# EAGLE schematic PROTO0001 (EAGLE 7.6.0)
ENGINEER: JTD; REV: A

## Sheet 1 of 4: Table of Contents
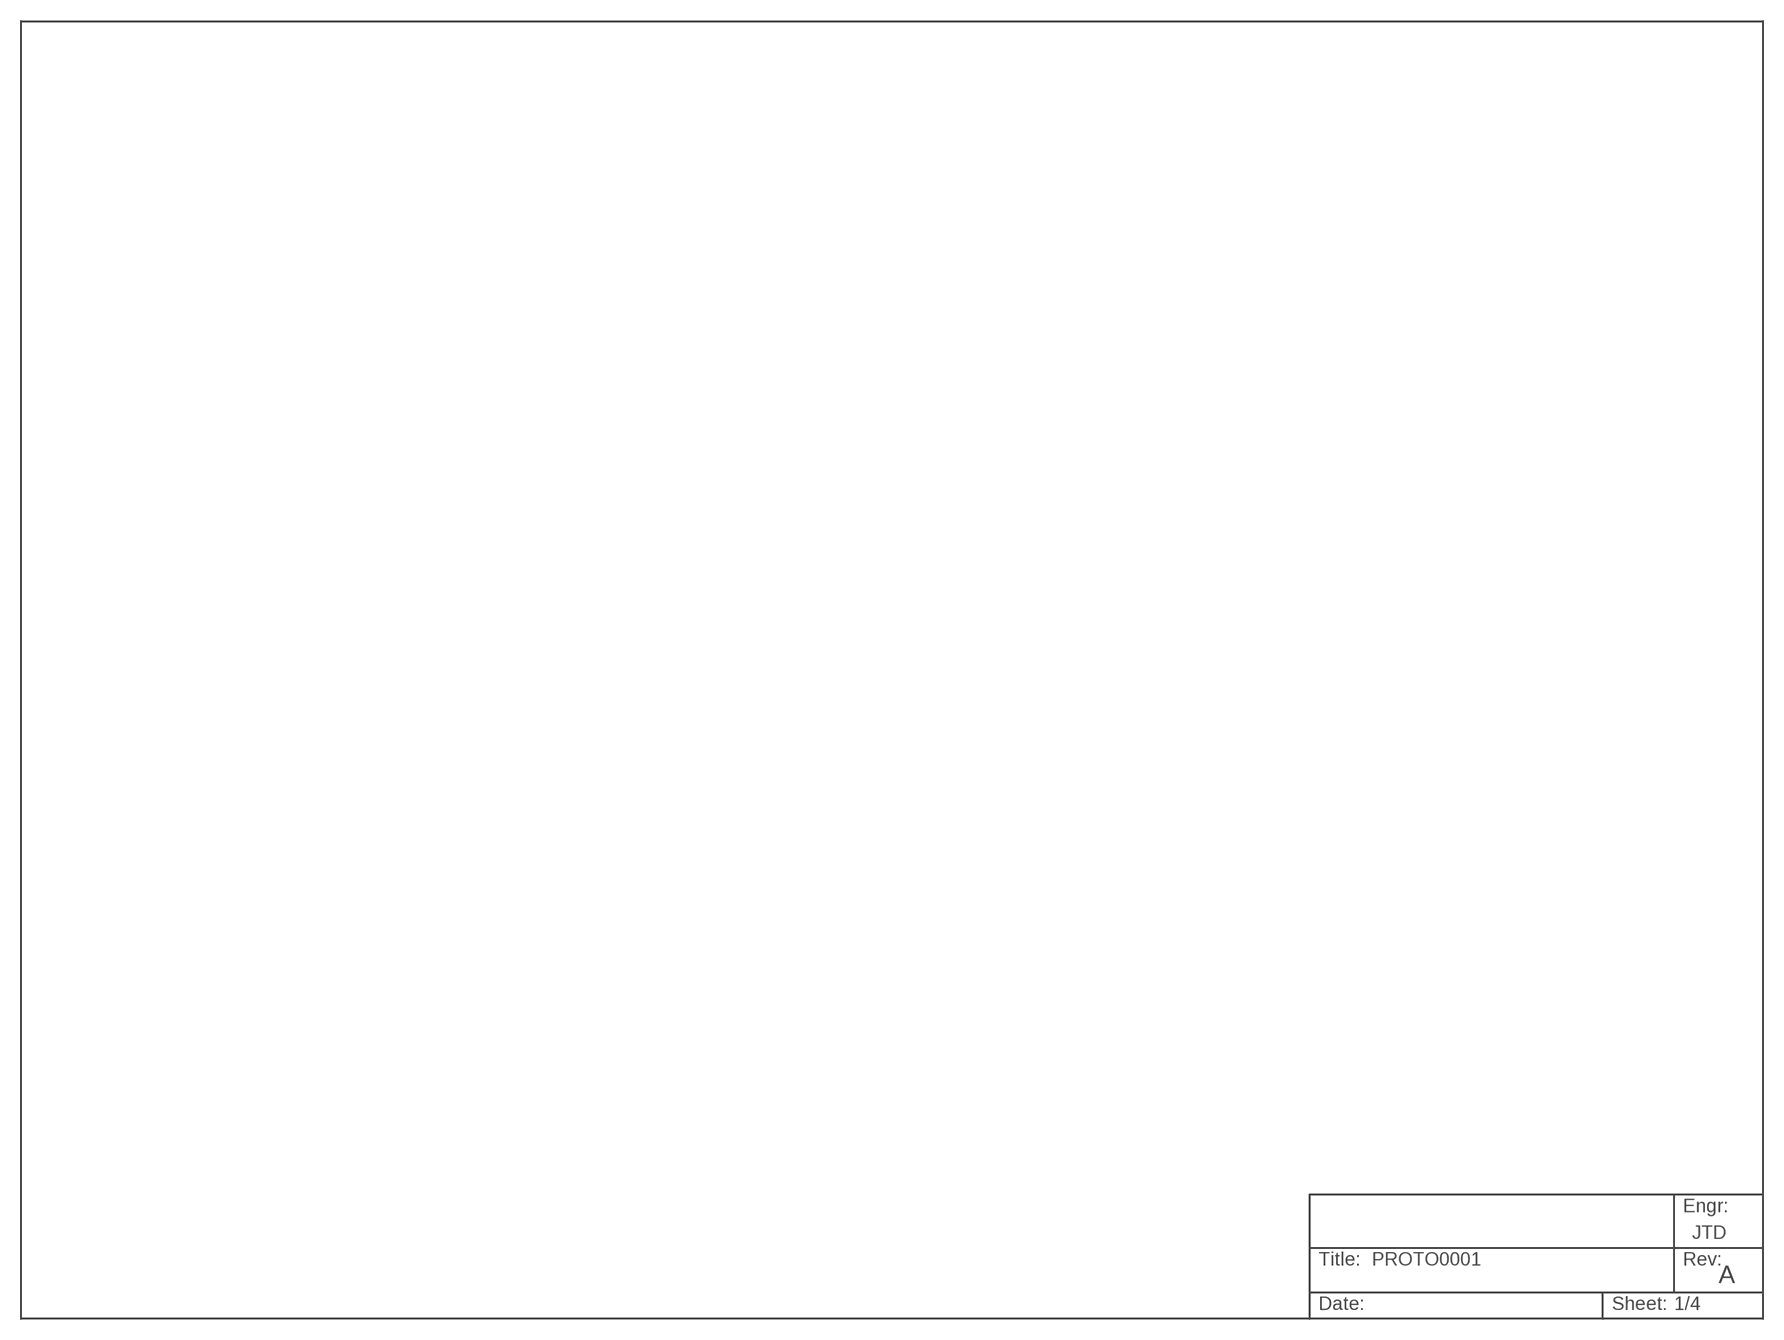
[diagram p0: schematic, sheet 1]
U$1 (FRAME_LANDSCAPE_A2): DESCRIPTION: Table of Contents and Revisions

## Sheet 2 of 4: MCU
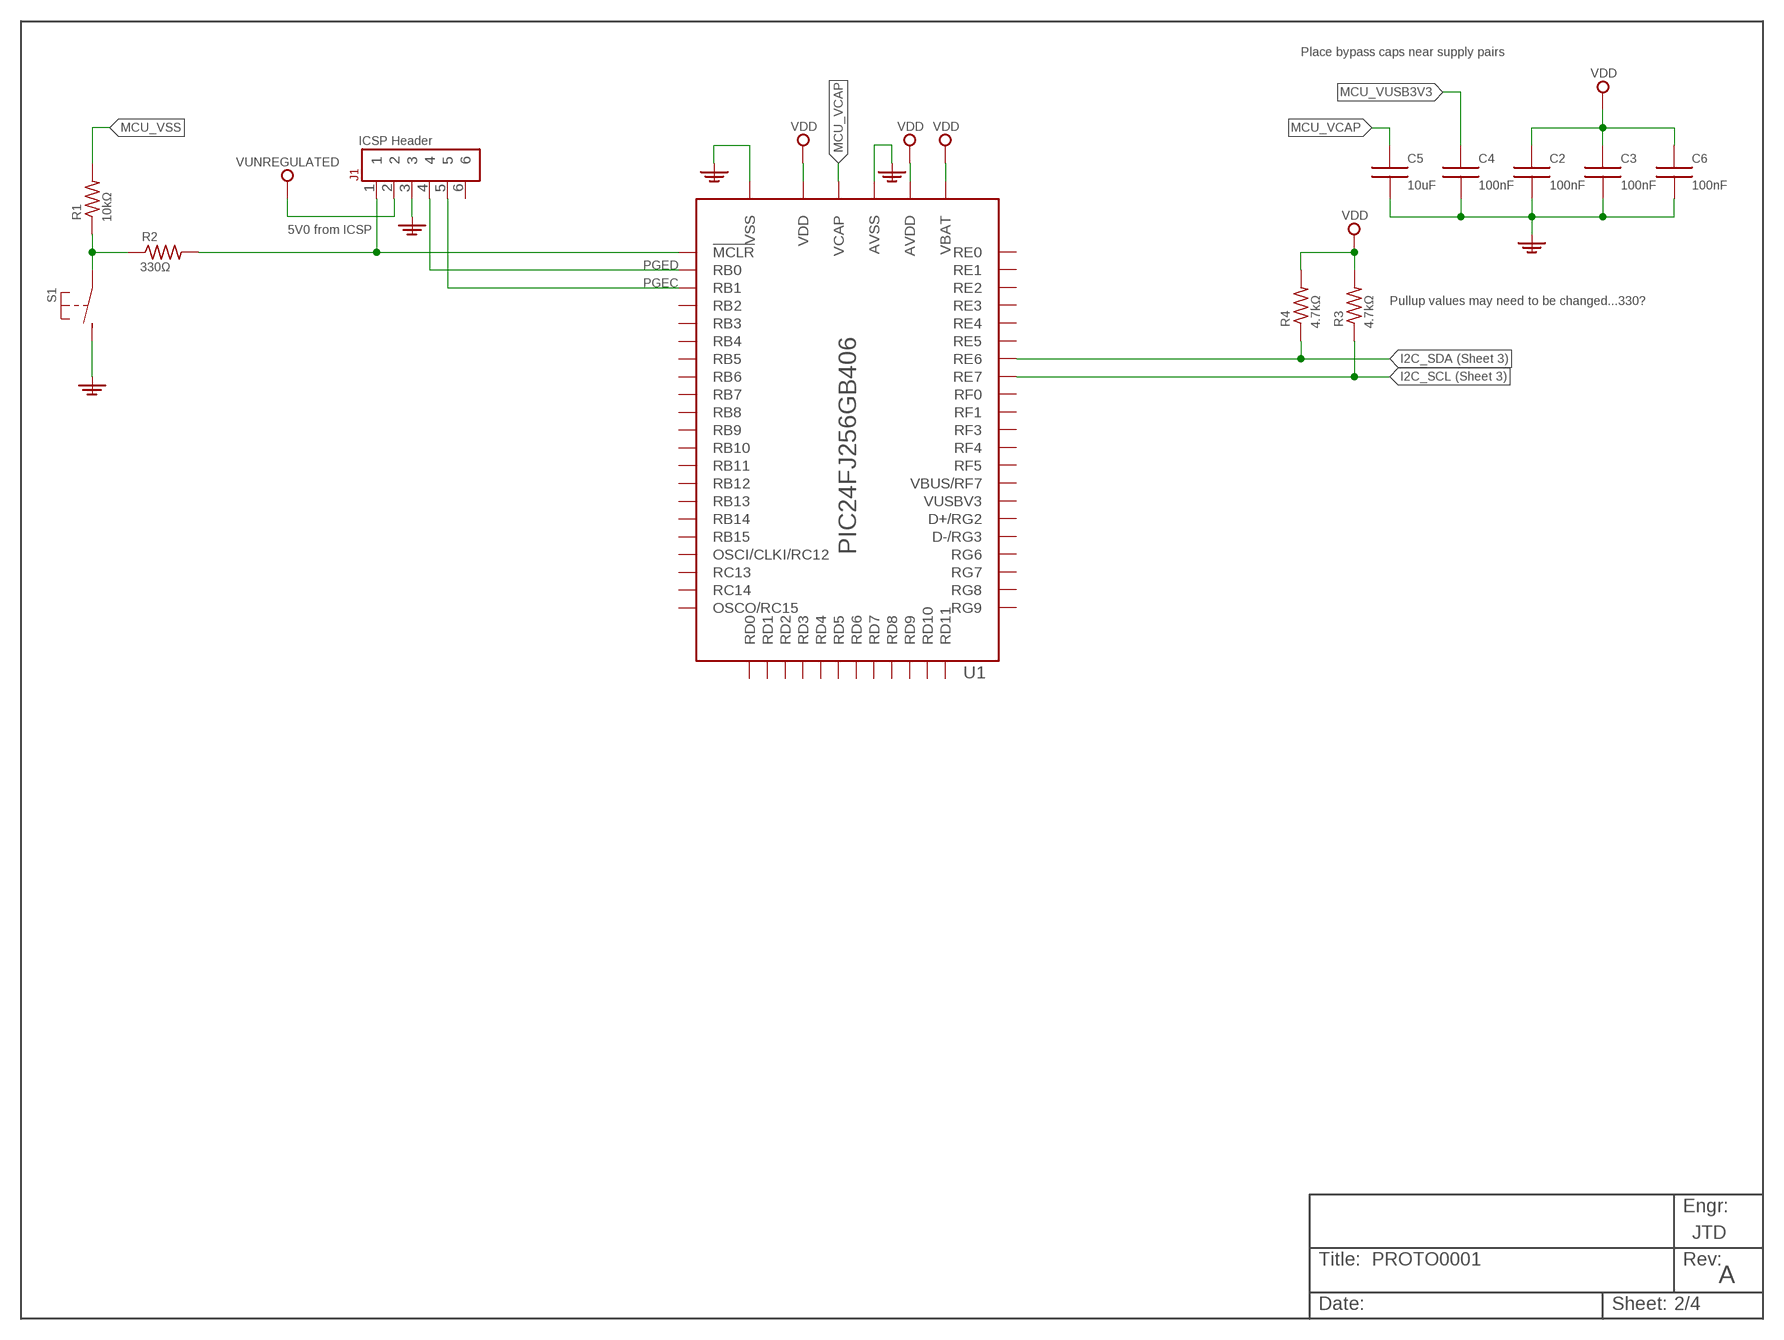
[diagram p1: schematic, sheet 2]

### Parts
C2  CAP_100N_0402_CERAMIC  [CAPACITOR_0402]
C3  CAP_100N_0402_CERAMIC  [CAPACITOR_0402]
C4  CAP_100N_0402_CERAMIC  [CAPACITOR_0402]
C5  CAP_10U_0805_CERAMIC  [CAPACITOR_0805]
C6  CAP_100N_0402_CERAMIC  [CAPACITOR_0402]
J1  HEADER_2.54MM_1X6  [HEADER_2.54MM_1X6]
R1  10.0kOhm  RES_10K_0402  [RESISTOR_0402]
R2  RES_330_0402  [RESISTOR_0402]
R3  RES_4.7K_0402  [RESISTOR_0402]
R4  RES_4.7K_0402  [RESISTOR_0402]
S1  SWITCH_TACTILE_THRU  [SWITCH_TACTILE_THRU]
U1  PIC24FJ256GB406  [QFP50P1200X1200X120-64L30]

### Nets
5V0: C2.1 C3.1 C6.1 R3.2 R4.2 U1.10(VDD) U1.19(AVDD) U1.26(VDD) U1.38(VDD) U1.57(VBAT) ; supply symbol labelled VDD ; also sheet 3
GND: C2.2 C3.2 C4.2 C5.2 C6.2 J1.3 S1.3(S) S1.4(S) U1.9(VSS) U1.20(AVSS) U1.25(VSS) U1.41(VSS) ; also sheet 3
I2C_SCL: R3.1 U1.3(RE7) ; also sheet 3
I2C_SDA: R4.1 U1.2(RE6) ; also sheet 3
MCU_VCAP: C5.1 U1.56(VCAP)
MCU_VSS: R1.2
MCU_VUSB3V3: C4.1
N$2: J1.1 R2.2 U1.7(!MCLR)
N$3: R1.1 R2.1 S1.1(P) S1.2(P)
PGEC: J1.5 U1.15(RB1)
PGED: J1.4 U1.16(RB0)
VUNREGULATED: J1.2
Unconnected: J1.6 U1.1(RE5) U1.4(RG6) U1.5(RG7) U1.6(RG8) U1.8(RG9) U1.11(RB5) U1.12(RB4) U1.13(RB3) U1.14(RB2) U1.17(RB6) U1.18(RB7) U1.21(RB8) U1.22(RB9) U1.23(RB10) U1.24(RB11) U1.27(RB12) U1.28(RB13) U1.29(RB14) U1.30(RB15) U1.31(RF4) U1.32(RF5) U1.33(RF3) U1.34(VBUS/RF7) U1.35(VUSBV3) U1.36(D-/RG3) U1.37(D+/RG2) U1.39(OSCI/CLKI/RC12) U1.40(OSCO/RC15) U1.42(RD8) U1.43(RD9) U1.44(RD10) U1.45(RD11) U1.46(RD0) U1.47(RC13) U1.48(RC14) U1.49(RD1) U1.50(RD2) U1.51(RD3) U1.52(RD4) U1.53(RD5) U1.54(RD6) U1.55(RD7) U1.58(RF0) U1.59(RF1) U1.60(RE0) U1.61(RE1) U1.62(RE2) U1.63(RE3) U1.64(RE4)

### Notes on the sheet
- Place bypass caps near supply pairs
- ICSP Header
- 5V0 from ICSP
- Pullup values may need to be changed...330?

## Sheet 3 of 4: I2C Peripherals
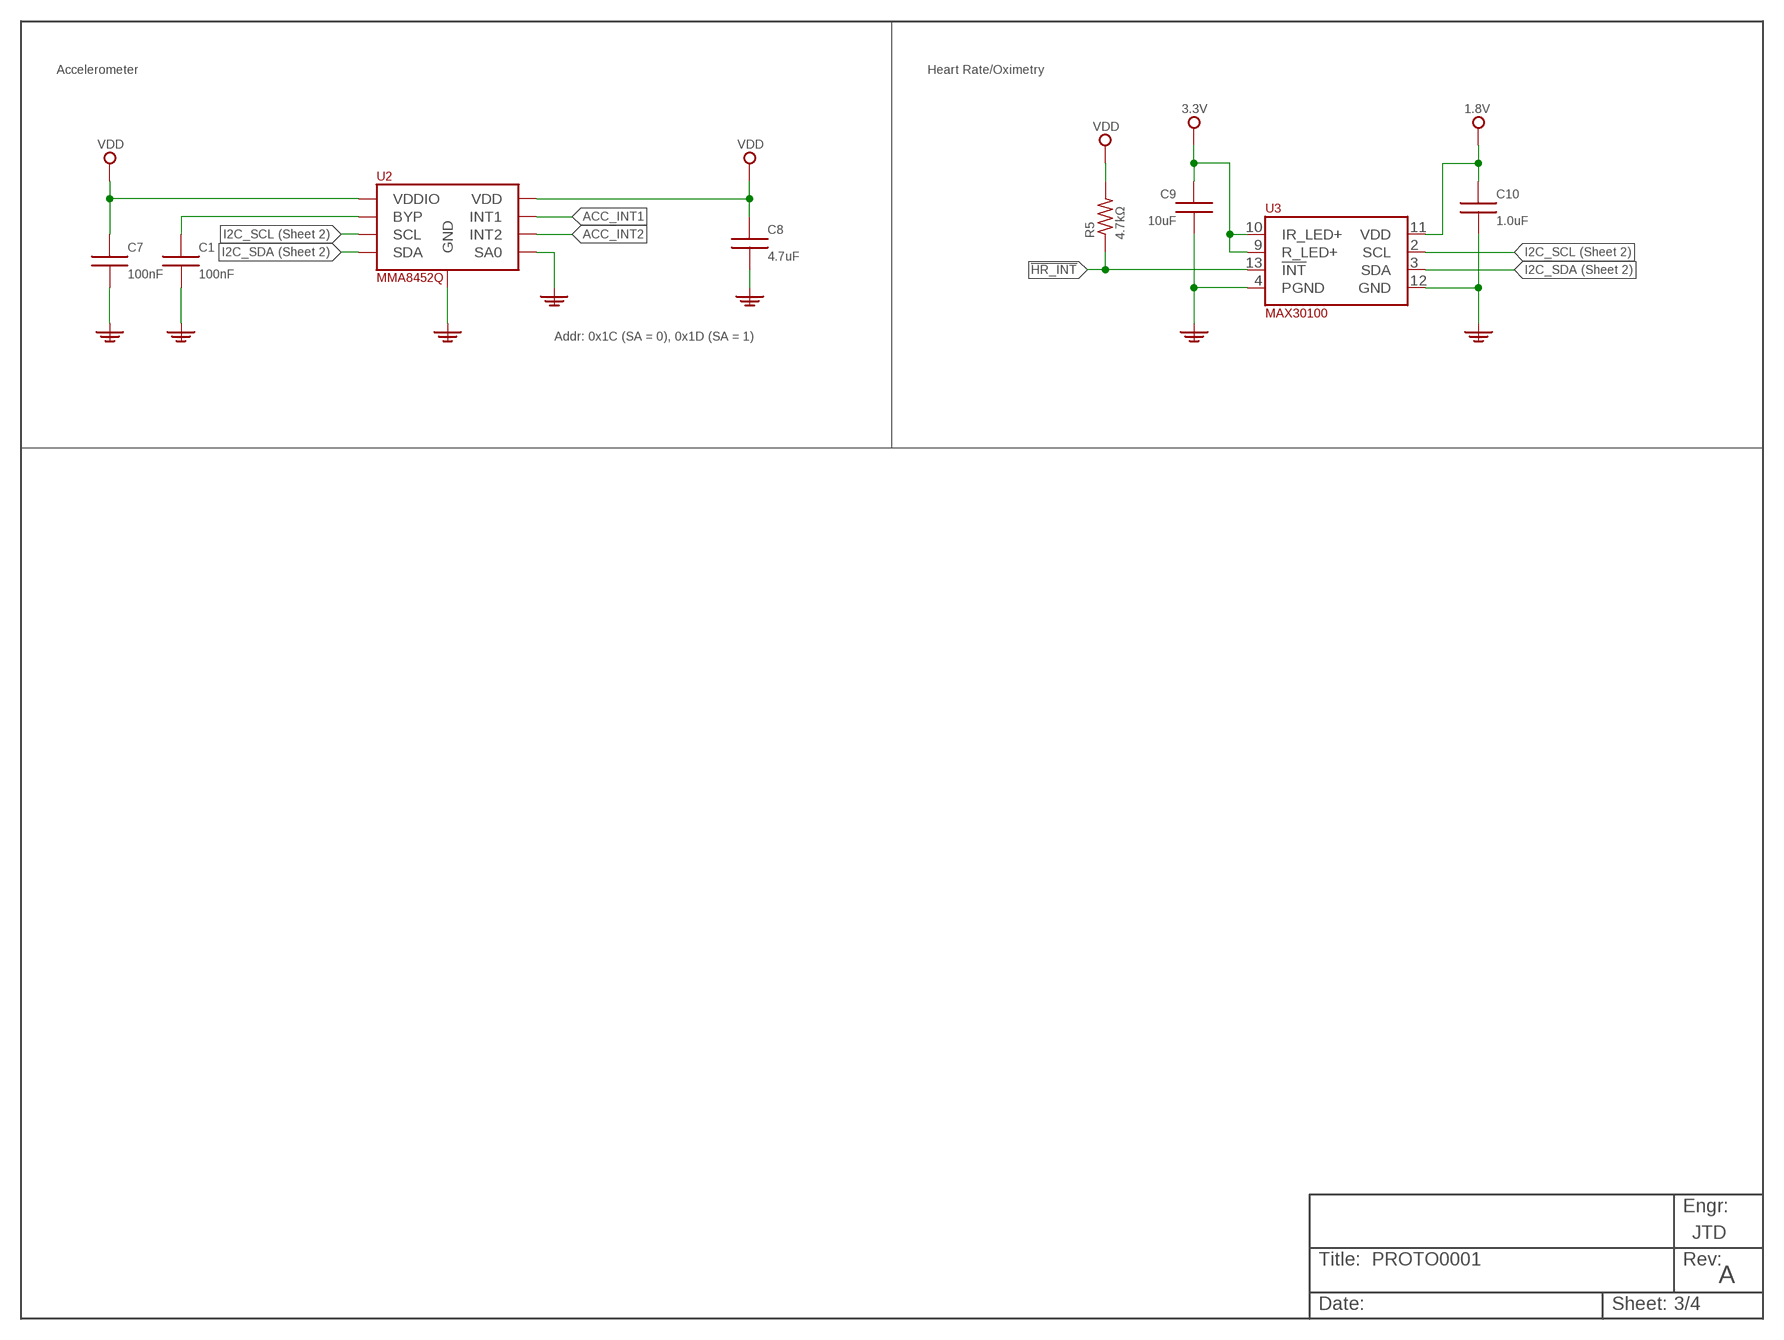
[diagram p2: schematic, sheet 3]

### Parts
C1  CAP_100N_0402_CERAMIC  [CAPACITOR_0402]
C7  CAP_100N_0402_CERAMIC  [CAPACITOR_0402]
C8  CAP_4.7U_0603_CERAMIC  [CAPACITOR_0603]
C9  CAP_10U_0805_CERAMIC  [CAPACITOR_0805]
C10  CAP_1U_0603_CERAMIC  [CAPACITOR_0603]
R5  RES_4.7K_0402  [RESISTOR_0402]
U2  MMA8452Q  [QFN50P300X300X100-16]
U3  MAX30100  [21-0880]

### Nets
1V8: C10.1 U3.11(VDD)
3V3: C9.1 U3.9(R_LED+) U3.10(IR_LED+)
5V0: C7.1 C8.1 R5.2 U2.1(VDDIO) U2.14(VDD) ; supply symbol labelled VDD ; also sheet 2
!HR_INT: R5.1 U3.13(!INT)
ACC_INT1: U2.11(INT1)
ACC_INT2: U2.9(INT2)
GND: C1.2 C7.2 C8.2 C9.2 C10.2 U2.5(GND) U2.7(SA0) U2.12(GND) U3.4(PGND) U3.12(GND) ; also sheet 2
I2C_SCL: U2.4(SCL) U3.2(SCL) ; also sheet 2
I2C_SDA: U2.6(SDA) U3.3(SDA) ; also sheet 2
N$1: C1.1 U2.2(BYP)

### Notes on the sheet
- Accelerometer | Heart Rate/Oximetry
- Addr: 0x1C (SA = 0), 0x1D (SA = 1)

## Sheet 4 of 4: GPS
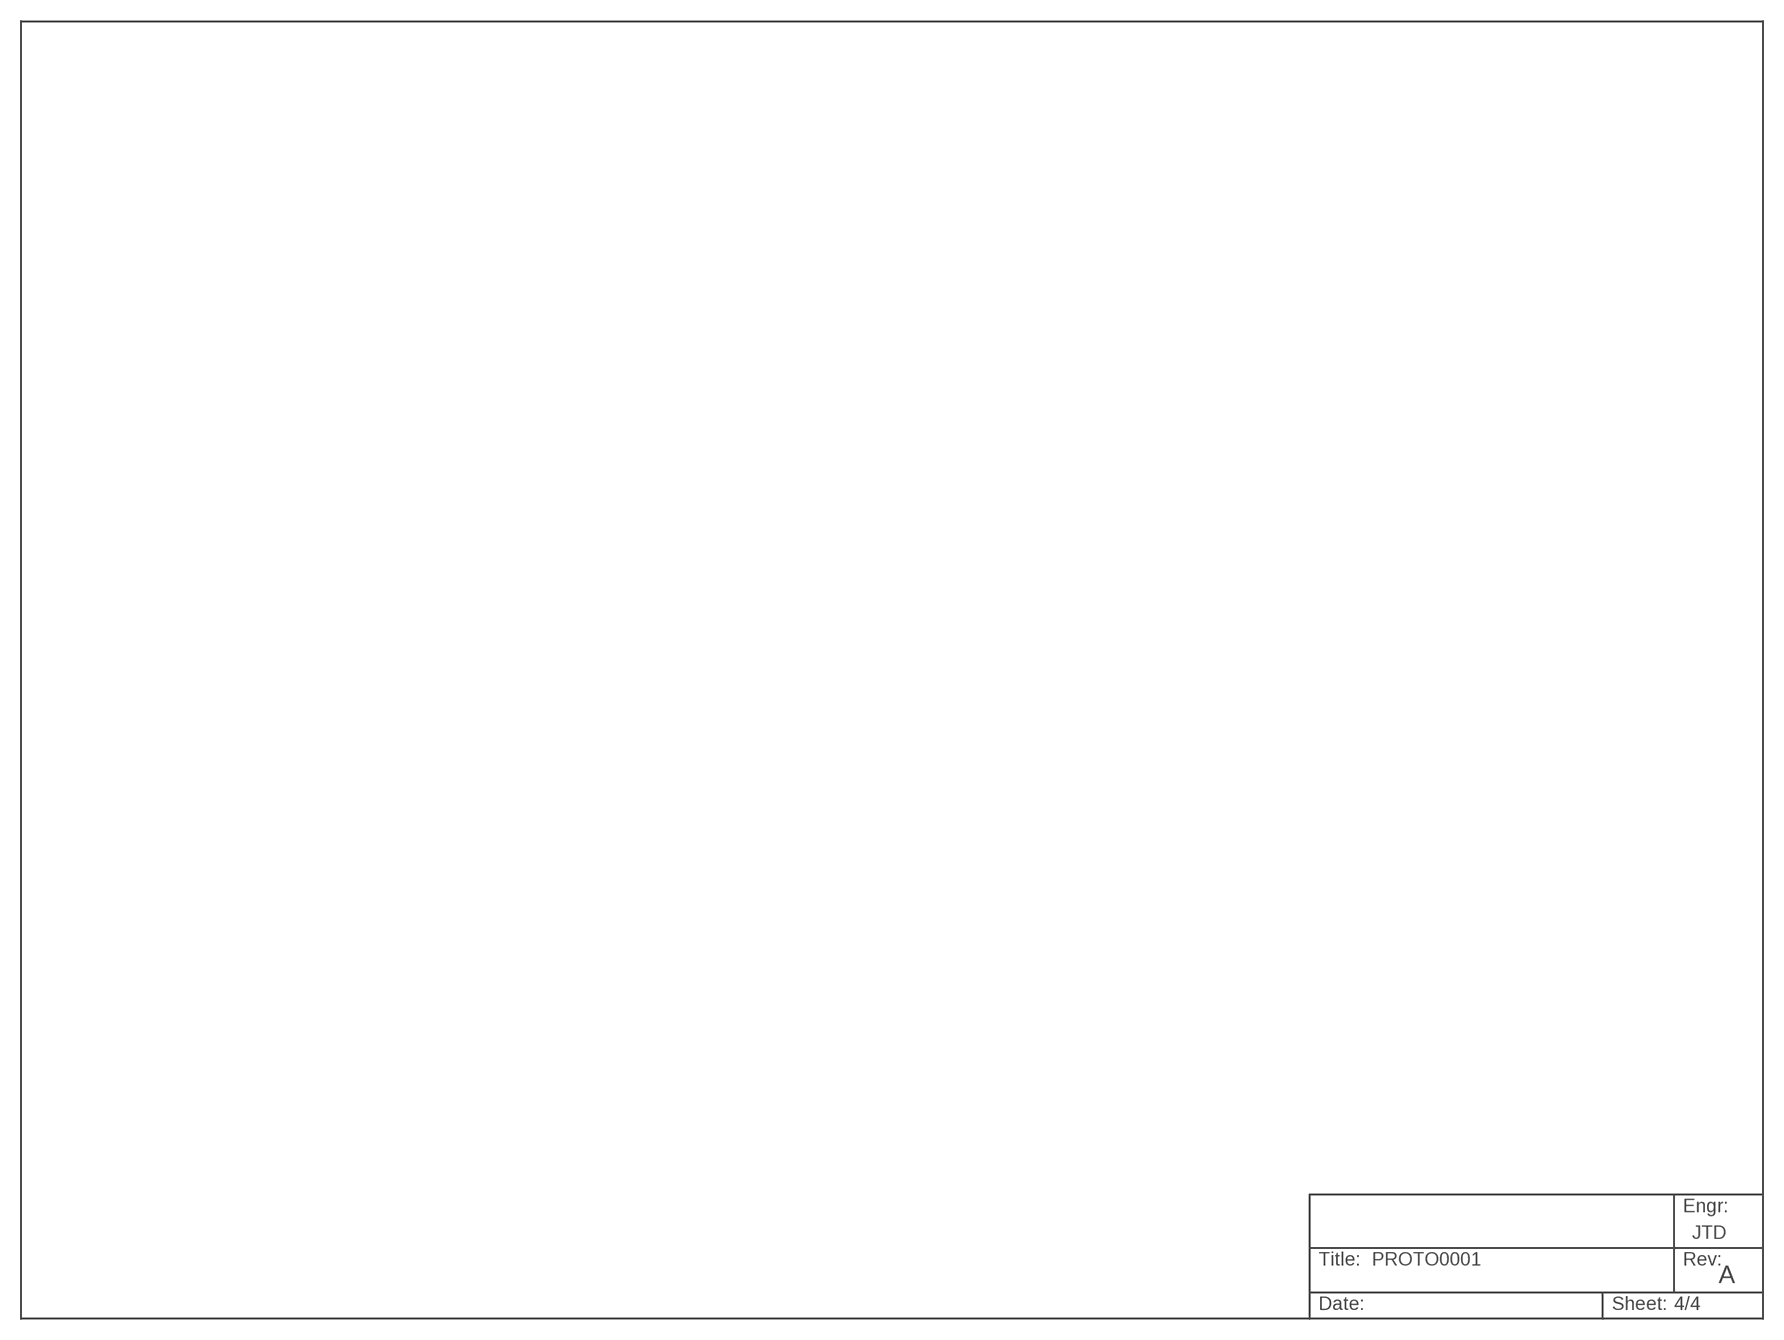
[diagram p3: schematic, sheet 4]

## Library data of the parts
C1-C4 C6 C7 = CattleFit:CAP_100N_0402_CERAMIC; CAPACITANCE: 100nF; MANUFACTURER: AVX Corporation; PARTNO: 04023C104KAT2A; TOLERANCE: 10%
C5 C9 = CattleFit:CAP_10U_0805_CERAMIC; CAPACITANCE: 10uF; MANUFACTURER: AVX Corporation; PARTNO: 0805YD106KAT2A
C8 = CattleFit:CAP_4.7U_0603_CERAMIC: 4.7uF Capacitor, Ceramic, 10V, +/-10%, X5R, 0603, -55C ~ 85C; CAPACITANCE: 4.7uF; MANUFACTURER: Murata Electronics; PARTNO: GRM188R61A475KE15D; TEMPERATURE: -55C ~ 85C; TOLERANCE: 10%
C10 = CattleFit:CAP_1U_0603_CERAMIC: 4.7uF Capacitor, Ceramic, 10V, +/-10%, X5R, 0603, -55C ~ 85C; CAPACITANCE: 1.0uF; MANUFACTURER: Murata Electronics; TEMPERATURE: -55C ~ 85C; TOLERANCE: 10%
J1 = CattleFit:HEADER_2.54MM_1X6: Header, 2.54mm pitch, 1x6
R1 = CattleFit:RES_10K_0402; MANUFACTURER: Yageo; PARTNO: RC0402FR-0710KL; RESISTANCE: 10kΩ; TOLERANCE: 1.0%
R2 = CattleFit:RES_330_0402; MANUFACTURER: Yageo; PARTNO: RC0402FR-07330RL; RESISTANCE: 330Ω; TOLERANCE: 1.0%
R3-R5 = CattleFit:RES_4.7K_0402; MANUFACTURER: Yageo; RESISTANCE: 4.7kΩ; TOLERANCE: 1.0%
S1 = CattleFit:SWITCH_TACTILE_THRU: Switch SPST Tactile NO 0.05A 12V -20°C to +60°C SWITCH_TACTILE_THROUGH; ACRONAME: PMISC00088; MANUFACTURER: C&K Components; PARTNUM: PTS645SM43-2 LFS; PROTO: PROTO00618
U1 = CattleFit:PIC24FJ256GB406; DESCRIPTION: 16-bit MCU; MANUFACTURER: Microchip; PARTNO: PIC24FJ256GB406
U2 = CattleFit:MMA8452Q; DESCRIPTION: 3-axis (X,Y,Z) Accelerometer, +/-2g ~ 8g, I2C; MANUFACTURER: Freescale Semiconductor; PARTNO: MMA8452Q
U3 = CattleFit:MAX30100; MANUFACTURER: Maxim Integrated; PARTNO: MAX30100